# Altium schematic sheet RobotCtrl_V2_Mother-board_Power.SchDoc
size A3; Author: Power Lin; DocumentNumber: 1; SheetNumber: 1; SheetTotal: 2; Website: wiki-power.com
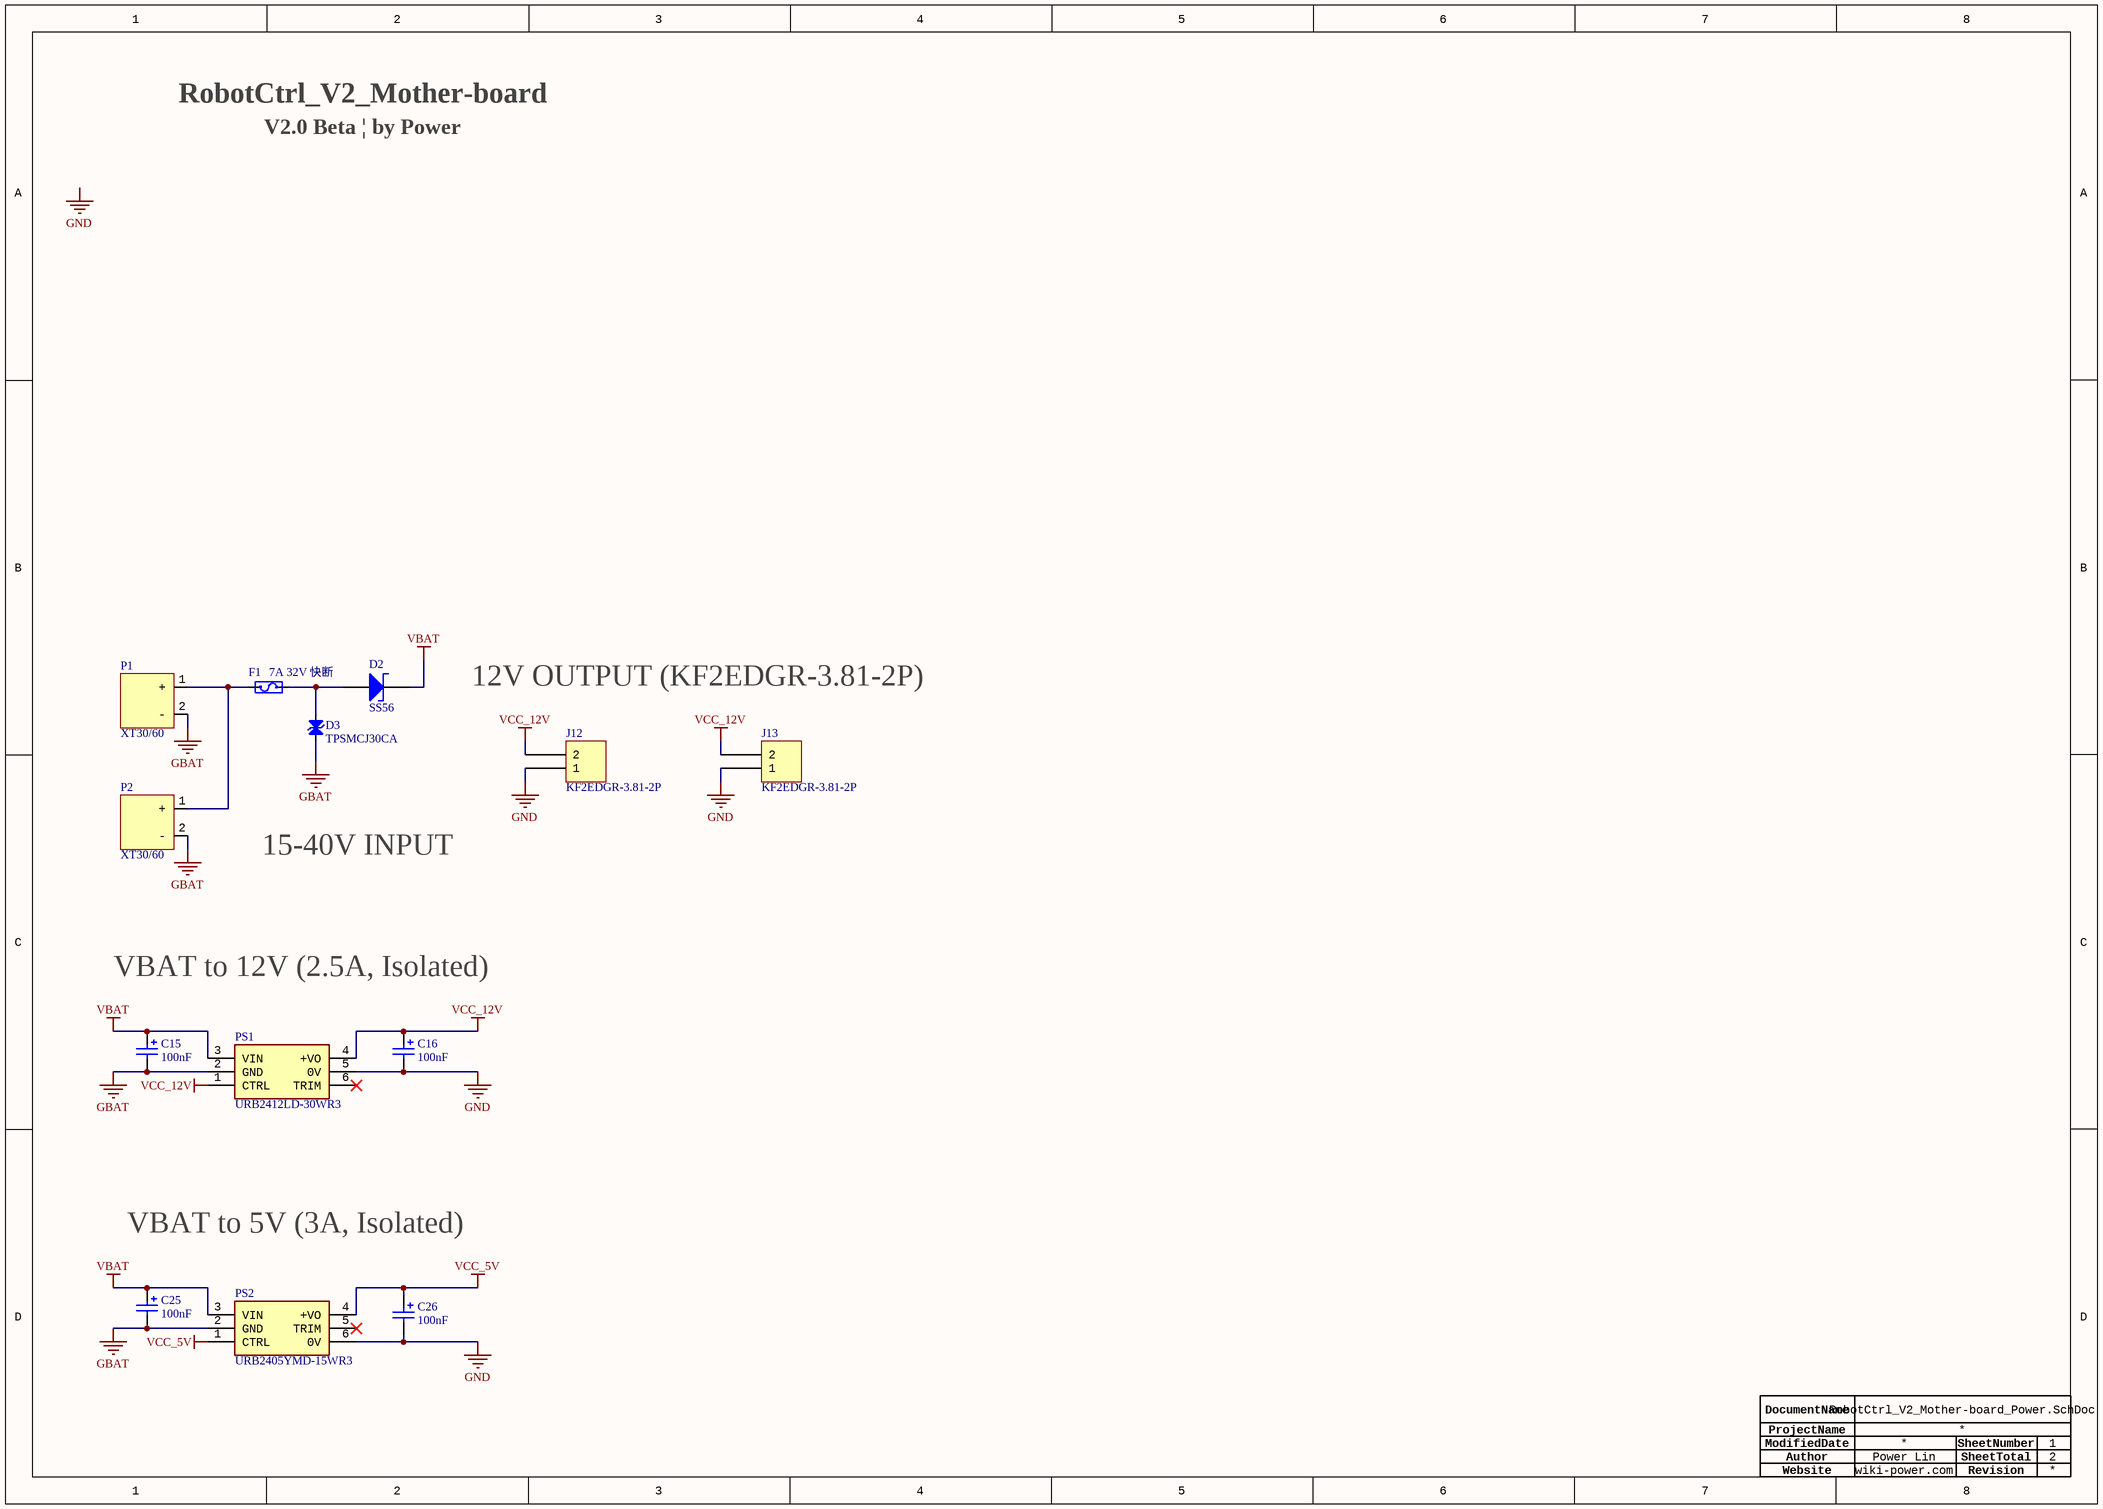
[diagram p0: RobotCtrl_V2_Mother-board_Power.SchDoc]

## Parts
C15  100nF  [CAP-AUX-3216]
C16  100nF  [CAP-AUX-3216]
C25  100nF  [CAP-AUX-3216]
C26  100nF  [CAP-AUX-3216]
D2  SS56  [DO-214AB/SMC]
D3  TPSMCJ30CA  [DO-214AB/SMC]
F1  7A 32V 快断  [FUSE_1206]
J12  KF2EDGR-3.81-2P  [FCI 06-381-2PIN]
J13  KF2EDGR-3.81-2P  [FCI 06-381-2PIN]
P1  XT30/60  [XT60PW-M]
P2  XT30/60  [XT60PW-M]
PS1  URB2412LD-30WR3  [URB2412LD30WR3]
PS2  URB2405YMD-15WR3  [URB2405YMD15WR3]

## Nets
GBAT: C15.2 C25.2 D3.1 P1.2(-) P2.2(-) PS1.2(GND) PS2.2(GND)
GND: C16.2 C26.2 J12.1 J13.1 PS1.5(0V) PS2.6(0V)
VBAT: C15.1 C25.1 D2.2(K) PS1.3(VIN) PS2.3(VIN)
VCC_5V: C26.1 PS2.1(CTRL) PS2.4(+VO)
VCC_12V: C16.1 J12.2 J13.2 PS1.1(CTRL) PS1.4(+VO)
NetD2_1: D2.1(A) D3.2 F1.2
NetF1_1: F1.1 P1.1(+) P2.1(+)

Not connected (* = marked no-connect by the designer): PS1 6(TRIM)*; PS2 5(TRIM)*

## Notes on the sheet
- RobotCtrl_V2_Mother-board
- V2.0 Beta | by Power
- 12V OUTPUT (KF2EDGR-3.81-2P)
- 15-40V INPUT
- VBAT to 12V (2.5A, Isolated)
- VBAT to 5V (3A, Isolated)
- Author
- DocumentName
- ModifiedDate
- ProjectName
- SheetNumber
- SheetTotal
- Website
- Revision
- Labels drawn without touching a wire or pin: GND

## Library data of the parts
C15 C16 C25 C26 = CAP-POL: KM101M050F115A; ComponentLink1Description: 供应商链接; ComponentLink1URL: http://www.szlcsc.com/product/details_16815.html; Package: 3528; Supplier: LC; SuppliersPartNumber: C16133
D2 = DIODE_Schottky: 肖特基二极管
D3 = TVS_C
F1 = Fuse: 0437007.WR
J12 J13 = KF2EDGR-3.81-2P: TERM BLOCK HDR 2POS 90DEG 3.81MM; Part Number: OQ0232510000G; Manufacturer: Amphenol Anytek; Manufacturer: Amphenol; Number of Levels: 1; Number of Positions: 2; Header Orientation: 90°, Right Angle; Current - UL: 10A; Pitch: 0.150" (3.81mm); Voltage - UL: 300V; Lifecycle Status: 0; ComponentLink1Description: Datasheet; Series: 06-381; Color: Green; Termination Style: Solder; Minimum Order: 1; Type: Header, Male Pins, Shrouded (4 Side); LastUpdated: 2019-12-16 19:14:30.110; Operating Temperature: -40°C ~ 115°C; Packaging: Bulk; ComponentLink1URL: http://portal.fciconnect.com/Comergent//fci/drawing/oqxx32x100j0g.pdf; Price: 0.49; Mounting Type: Through Hole; Positions Per Level: 2; Contact Mating Finish: Tin; Part Status: Active; Manufacturer Part Number: OQ0232510000G; Component Type: 接线端子
PS1 = URB2412LD-30WR3: 金升阳隔离电源; Manufacturer_Name: Mornsun; Manufacturer_Part_Number: URB2412LD-30WHR3; Datasheet Link: https://4donline.ihs.com/images/VipMasterIC/IC/MNSN/MNSN-S-A0002273855/MNSN-S-A0002273855-1.pdf?hkey=EF798316E3902B6ED9A73243A3159BB0; Height: 16.8mm
PS2 = URB2405YMD-15WR3: 金升阳隔离电源; Manufacturer_Name: Mornsun; Manufacturer_Part_Number: URB2405YMD-10WR3; Datasheet Link: https://www.mornsun-power.com/html/pdf/URB2405YMD-10WR3.html; Height: 12.2mm